# Altium schematic sheet 1-Power.SCHDOC: 控制板
size A4; CompanyName: 然源电子; DrawnBy: lzl; Revision: Rev 01
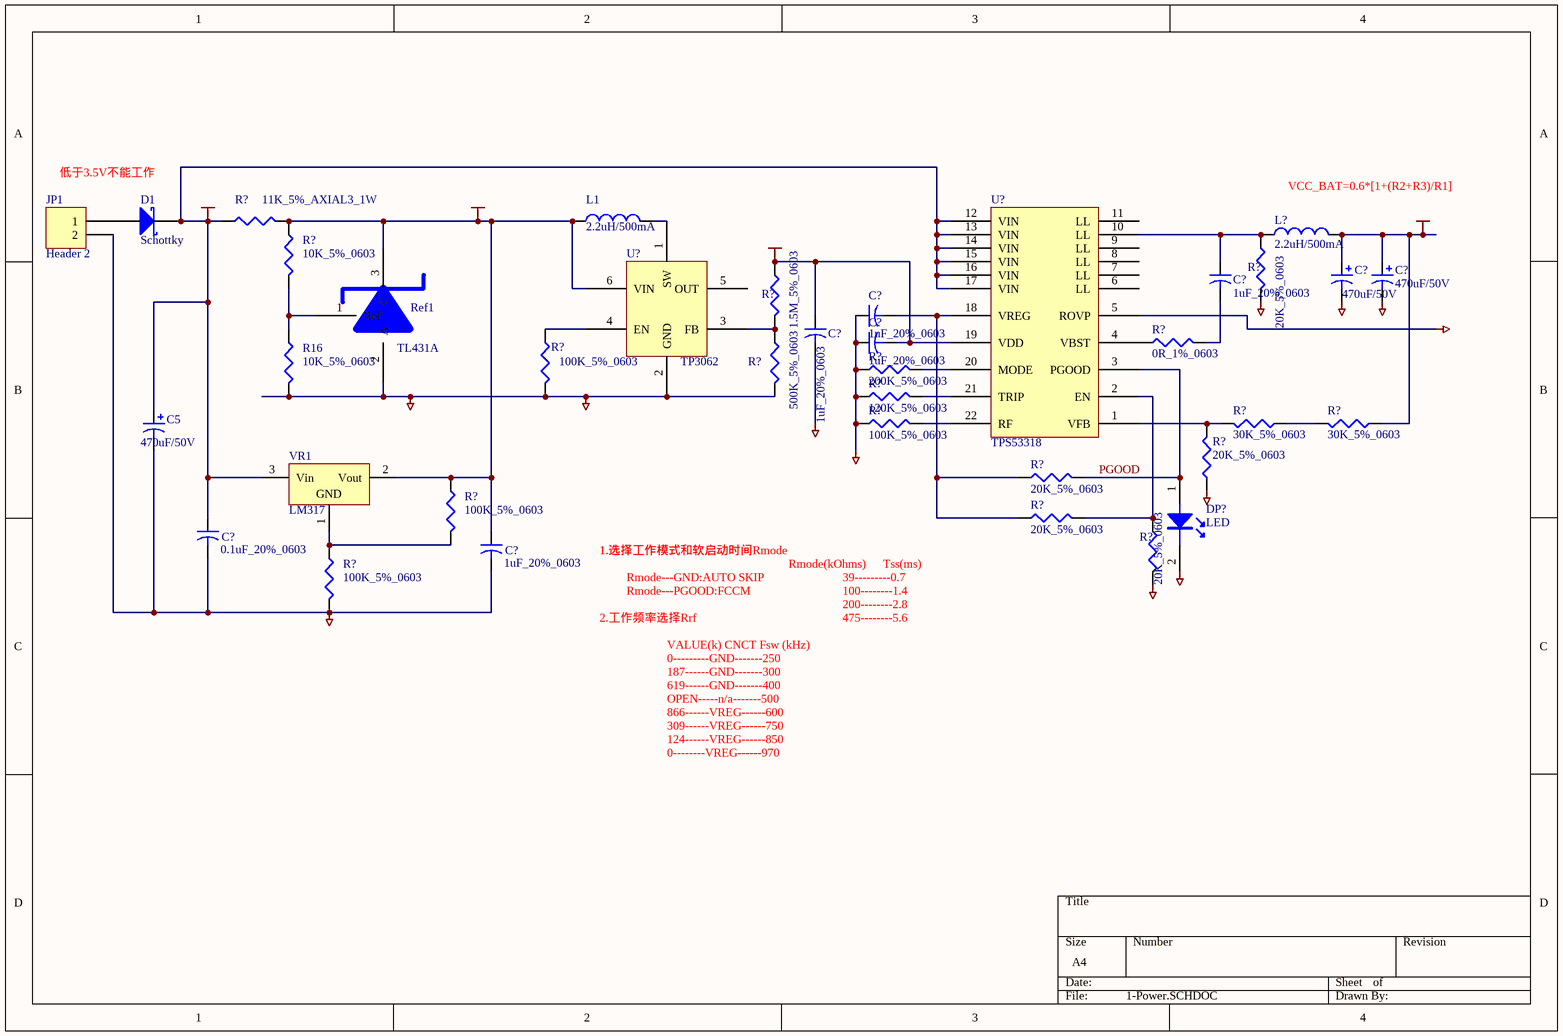
[diagram p0: 1-Power.SCHDOC]

## Parts
(Parts that share a designator on the sheet are numbered #1, #2 ... from top to bottom, then left to right.)
C5  value 470uF/50V  [ECAP-TP10]  (hidden comment: Cap Pol2)
C?#1  1uF_20%_0603  [C1608-0603]
C?#2  value 470uF/50V  [ECAP-TP10]  (hidden comment: Cap Pol2)
C?#3  value 470uF/50V  [ECAP-TP10]  (hidden comment: Cap Pol2)
C?#4  1uF_20%_0603  [C1608-0603]
C?#5  1uF_20%_0603  [C1608-0603]
C?#6  1uF_20%_0603  [C1608-0603]
C?#7  0.1uF_20%_0603  [C1608-0603]
C?#8  1uF_20%_0603  [C1608-0603]
D1  Schottky  [DO-214AA_785X100_200X160A100L_P]
DP?  LED  [LED0805]
JP1  Header 2  [CN5.08 10x10]
L1  value 2.2uH/500mA  [l100]  (hidden comment: Inductor)
L?  value 2.2uH/500mA  [l100]  (hidden comment: Inductor)
R16  10K_5%_0603  [C1608-0603]
R?#1  11K_5%_AXIAL3_1W  [C1608-0603]
R?#2  10K_5%_0603  [C1608-0603]
R?#3  20K_5%_0603  [C1608-0603]
R?#4  1.5M_5%_0603  [C1608-0603]
R?#5  0R_1%_0603  [C1608-0603]
R?#6  100K_5%_0603  [C1608-0603]
R?#7  500K_5%_0603  [C1608-0603]
R?#8  200K_5%_0603  [C1608-0603]
R?#9  120K_5%_0603  [C1608-0603]
R?#10  100K_5%_0603  [C1608-0603]
R?#11  30K_5%_0603  [C1608-0603]
R?#12  30K_5%_0603  [C1608-0603]
R?#13  20K_5%_0603  [C1608-0603]
R?#14  20K_5%_0603  [C1608-0603]
R?#15  100K_5%_0603  [C1608-0603]
R?#16  20K_5%_0603  [C1608-0603]
R?#17  20K_5%_0603  [C1608-0603]
R?#18  100K_5%_0603  [C1608-0603]
Ref1  TL431A  [TO-92]
U?#1  TP3062
U?#2  TPS53318
VR1  LM317  [252]

## Nets
PGND: C5.2 C?#2.2 C?#3.2 C?#4.1 C?#5.2 C?#6.1 C?#7.2 C?#8.2 DP?.2 JP1.2 R16.2 R?#3.2 R?#6.2 R?#7.2 R?#8.1 R?#9.1 R?#10.1 R?#14.1 R?#17.2 R?#18.2 Ref1.2(A) U?#1.2(GND) U?#2.5(ROVP)
VCC_BOOST_3.5V: C?#8.1 L1.1 R?#1.2 R?#2.1 R?#15.1 Ref1.3(C) U?#1.6(VIN) VR1.2(Vout)
VCC_BOOST_5V: C?#5.1 C?#6.2 R?#4.1 U?#2.19(VDD)
VCC_CHARGE: C?#2.1 C?#3.1 L?.2 R?#12.1
VCC_IN: C5.1 C?#7.1 D1.2(K) R?#1.1 U?#2.12(VIN) U?#2.13(VIN) U?#2.14(VIN) U?#2.15(VIN) U?#2.16(VIN) U?#2.17(VIN) VR1.3(Vin)
PGOOD: DP?.1 R?#13.2 U?#2.3(PGOOD)
NetC?#1_1: C?#1.1 L?.1 R?#3.1 U?#2.10(LL)
NetC?#1_2: C?#1.2 R?#5.2
NetC?#4_2: C?#4.2 R?#13.1 R?#16.1 U?#2.18(VREG)
NetD1_1: D1.1(A) JP1.1
NetL1_2: L1.2 U?#1.1(SW)
NetR16_1: R16.1 R?#2.2 Ref1.1(Ref)
NetR?#4_2: R?#4.2 R?#7.1 U?#1.3(FB)
NetR?#5_1: R?#5.1 U?#2.4(VBST)
NetR?#6_1: R?#6.1 U?#1.4(EN)
NetR?#8_2: R?#8.2 U?#2.20(MODE)
NetR?#9_2: R?#9.2 U?#2.21(TRIP)
NetR?#10_2: R?#10.2 U?#2.22(RF)
NetR?#11_1: R?#11.1 R?#12.2
NetR?#11_2: R?#11.2 R?#14.2 U?#2.1(VFB)
NetR?#15_2: R?#15.2 R?#18.1 VR1.1(ADJ)
NetR?#16_2: R?#16.2 R?#17.1 U?#2.2(EN)

Not connected (* = marked no-connect by the designer): U?#1 5(OUT); U?#2 6(LL) 7(LL) 8(LL) 9(LL) 11(LL)

## Notes on the sheet
- 低于3.5V不能工作
- VCC_BAT=0.6*[1+(R2+R3)/R1]
- 1.选择工作模式和软启动时间Rmode
- 1.选择工作模式和软启动时间
- Rmode---GND:AUTO SKIP
- Rmode(kOhms)
- 39---------0.7
- Tss(ms)
- 2.工作频率选择Rrf
- Rmode---PGOOD:FCCM
- VALUE(k) CNCT Fsw (kHz)
- 100--------1.4
- 200--------2.8
- 475--------5.6
- 0---------GND-------250
- 187------GND-------300
- 619------GND-------400
- OPEN-----n/a-------500
- 866------VREG------600
- 309------VREG------750
- 124------VREG------850
- 0--------VREG------970
- (in symbol Volt Reg) GND

## Library data of the parts
C5 C?#2 C?#3 = Cap Pol2: Polarized Capacitor (Axial); Published: 8-Jun-2000; Revision: July-2002: Re-released for DXP Platform.; Publisher: Altium Limited
C?#1 C?#4-C?#8 = Cap2: Capacitor; Value: 0.1uF 20% 0603; Published: 23-Sep-2002; Publisher: Altium Limited
D1 = D Schottky: Schottky Diode; Code - JEDEC: DO-214-AA; Published: 8-Jun-2000; Revision: July-2002: Re-released for DXP Platform.; Publisher: Altium Limited
JP1 = Header 2: Header, 2-Pin; Revision: 17-Jul-2002: Re-released for DXP Platform.; Publisher: Altium Limited
R16 R?#1-R?#18 = Res3: Resistor; Value: 150R %5 0603; Published: 8-Jun-2000; Revision: July-2002: Re-released for DXP Platform.; Publisher: Altium Limited
U?#1 = TP3602
U?#2 = TPS53318/9
VR1 = Volt Reg: Voltage Regulator; Code - JEDEC: SMD-220; Published: 24-Mar-1999; Revision: July-2002: Re-released for DXP Platform.; Publisher: Altium Limited
L1 L? = Inductor: Published: 8-Jun-2000; Revision: July-2002: Re-released for DXP Platform.; Publisher: Altium Limited